# EAGLE schematic newbrd (EAGLE 7.6.0)
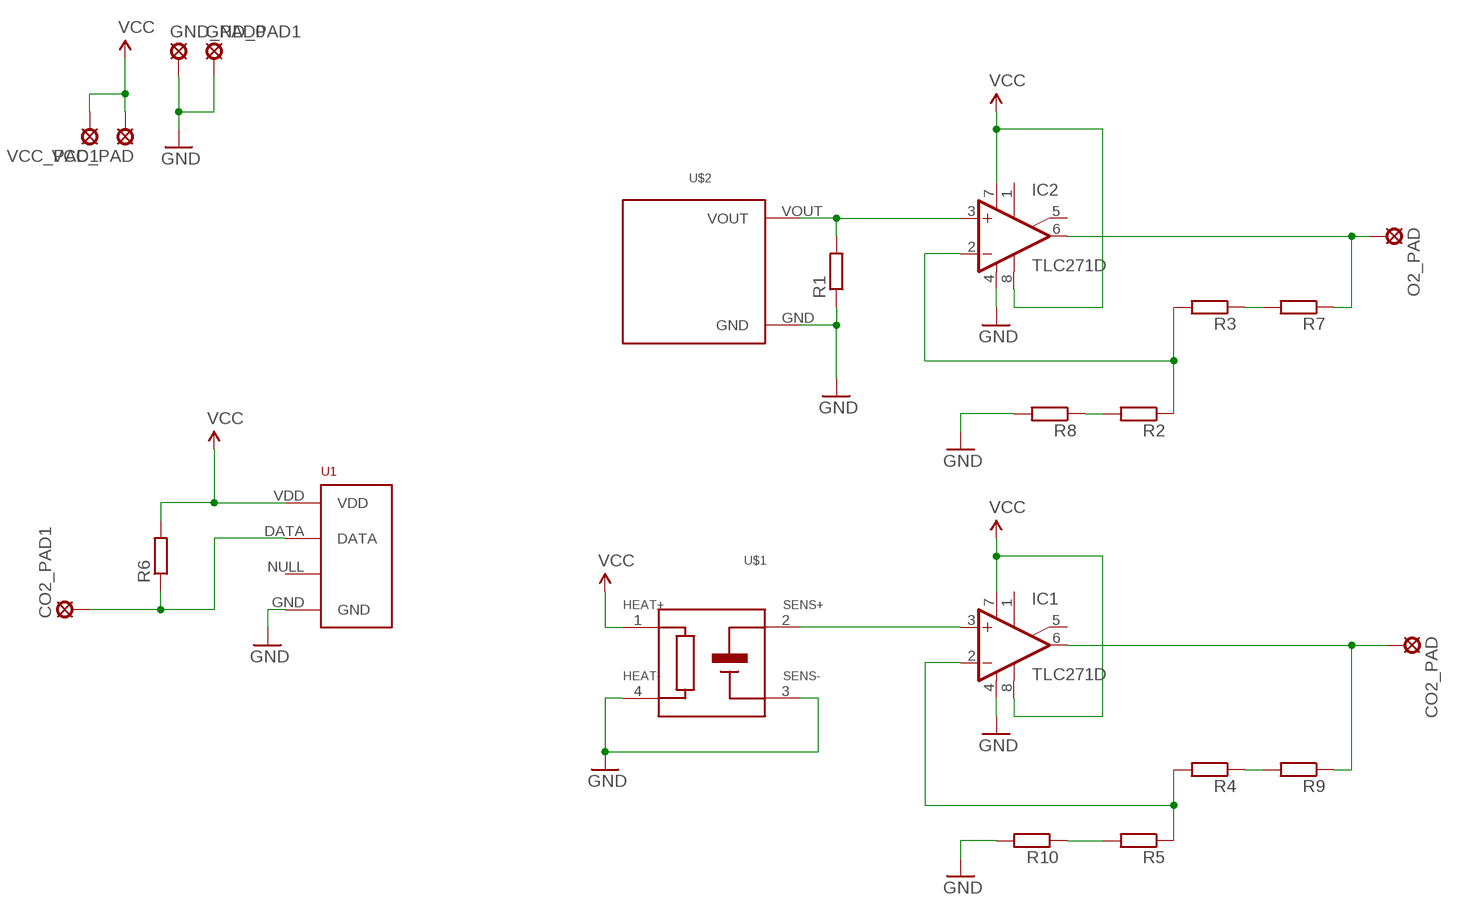
[diagram p0: schematic, sheet 1]

## Parts
CO2_PAD  LSP10  [LSP10]
CO2_PAD1  LSP10  [LSP10]
GND_PAD0  LSP10  [LSP10]
GND_PAD1  LSP10  [LSP10]
IC1  TLC271D  [SO08]
IC2  TLC271D  [SO08]
O2_PAD  LSP10  [LSP10]
R1  R-EU_R0805  [R0805]
R2  R-EU_R0805  [R0805]
R3  R-EU_R0805  [R0805]
R4  R-EU_R0805  [R0805]
R5  R-EU_R0805  [R0805]
R6  R-EU_R0805  [R0805]
R7  R-EU_R0805  [R0805]
R8  R-EU_R0805  [R0805]
R9  R-EU_R0805  [R0805]
R10  R-EU_R0805  [R0805]
U1  RHT03_DHT-22_AM2302RA  [RHT03_DHT-22/RA]
U$1  TGS4161  [TGS4161]
U$2  O2-A2  [O2-A2]
VCC_PAD  LSP10  [LSP10]
VCC_PAD1  LSP10  [LSP10]

## Nets
GND: GND_PAD0.MP GND_PAD1.MP IC1.4(V-) IC2.4(V-) R1.1 R8.2 R10.2 U1.GND U$1.3(SENS-) U$1.4(HEAT-) U$2.GND
N$1: IC2.3(+IN) R1.2 U$2.VOUT
N$2: CO2_PAD1.MP R6.1 U1.DATA
N$3: IC2.2(-IN) R2.1 R3.2
N$4: IC2.6(OUT) O2_PAD.MP R7.1
N$5: IC1.3(+IN) U$1.2(SENS+)
N$6: CO2_PAD.MP IC1.6(OUT) R9.1
N$7: R3.1 R7.2
N$8: R2.2 R8.1
N$10: R4.1 R9.2
N$11: R5.2 R10.1
N$13: IC1.2(-IN) R4.2 R5.1
VCC: IC1.7(V+) IC1.8(OPT) IC2.7(V+) IC2.8(OPT) R6.2 U1.VDD U$1.1(HEAT+) VCC_PAD1.MP VCC_PAD.MP
Unconnected: IC1.1(ON1) IC1.5(ON2) IC2.1(ON1) IC2.5(ON2) U1.NULL

## Library data of the parts
CO2_PAD CO2_PAD1 GND_PAD0 GND_PAD1 O2_PAD VCC_PAD VCC_PAD1 = solpad:LSP10: SOLDER PAD drill 1.0 mm, distributor Buerklin, 12H555
IC1 IC2 = linear:TLC271: OP AMP
R1-R10 = resistor:R-EU_: RESISTOR, European symbol
U1 = RHT03_DHT-22_AM2302:RHT03_DHT-22_AM2302: RHT03 / DHT-22 / AM2302 Packages and symbol for the RHT03 / DHT-22 relative humidity and temperature sensor. Note: The AM2302 is a wired version of the DHT-22 which typically requires less clearance and is thus provided as a separate package.; PROD_ID: SEN-10167
U$1 = datchiki:TGS4161: TGS4161 The Figaro TGS4161 is a new solid electrolyte type sensor which offers miniaturization, low power consumption, and long life. The TGS4161 displays high selectivity to carbon dioxide. Also, the TGS4161 displays good long term stability and shows excellent durability against the effects of high humidity through the application of innovative technology in the sensor’s electrode design. http://www.netzmafia.de/skripten/hardware/Datenblaetter/Gassensoren/TGS4161Dtl.pdf
U$2 = datchiki:O2-A2: O2-A2 Oxy O2-A2 Oxygen Sensor en Sensor http://www.alphasense.com/WEB1213/wp-content/uploads/2015/09/O2A2.pdf